# EAGLE schematic FS20SM8_DFF_MPC23017 (EAGLE 7.3.0)
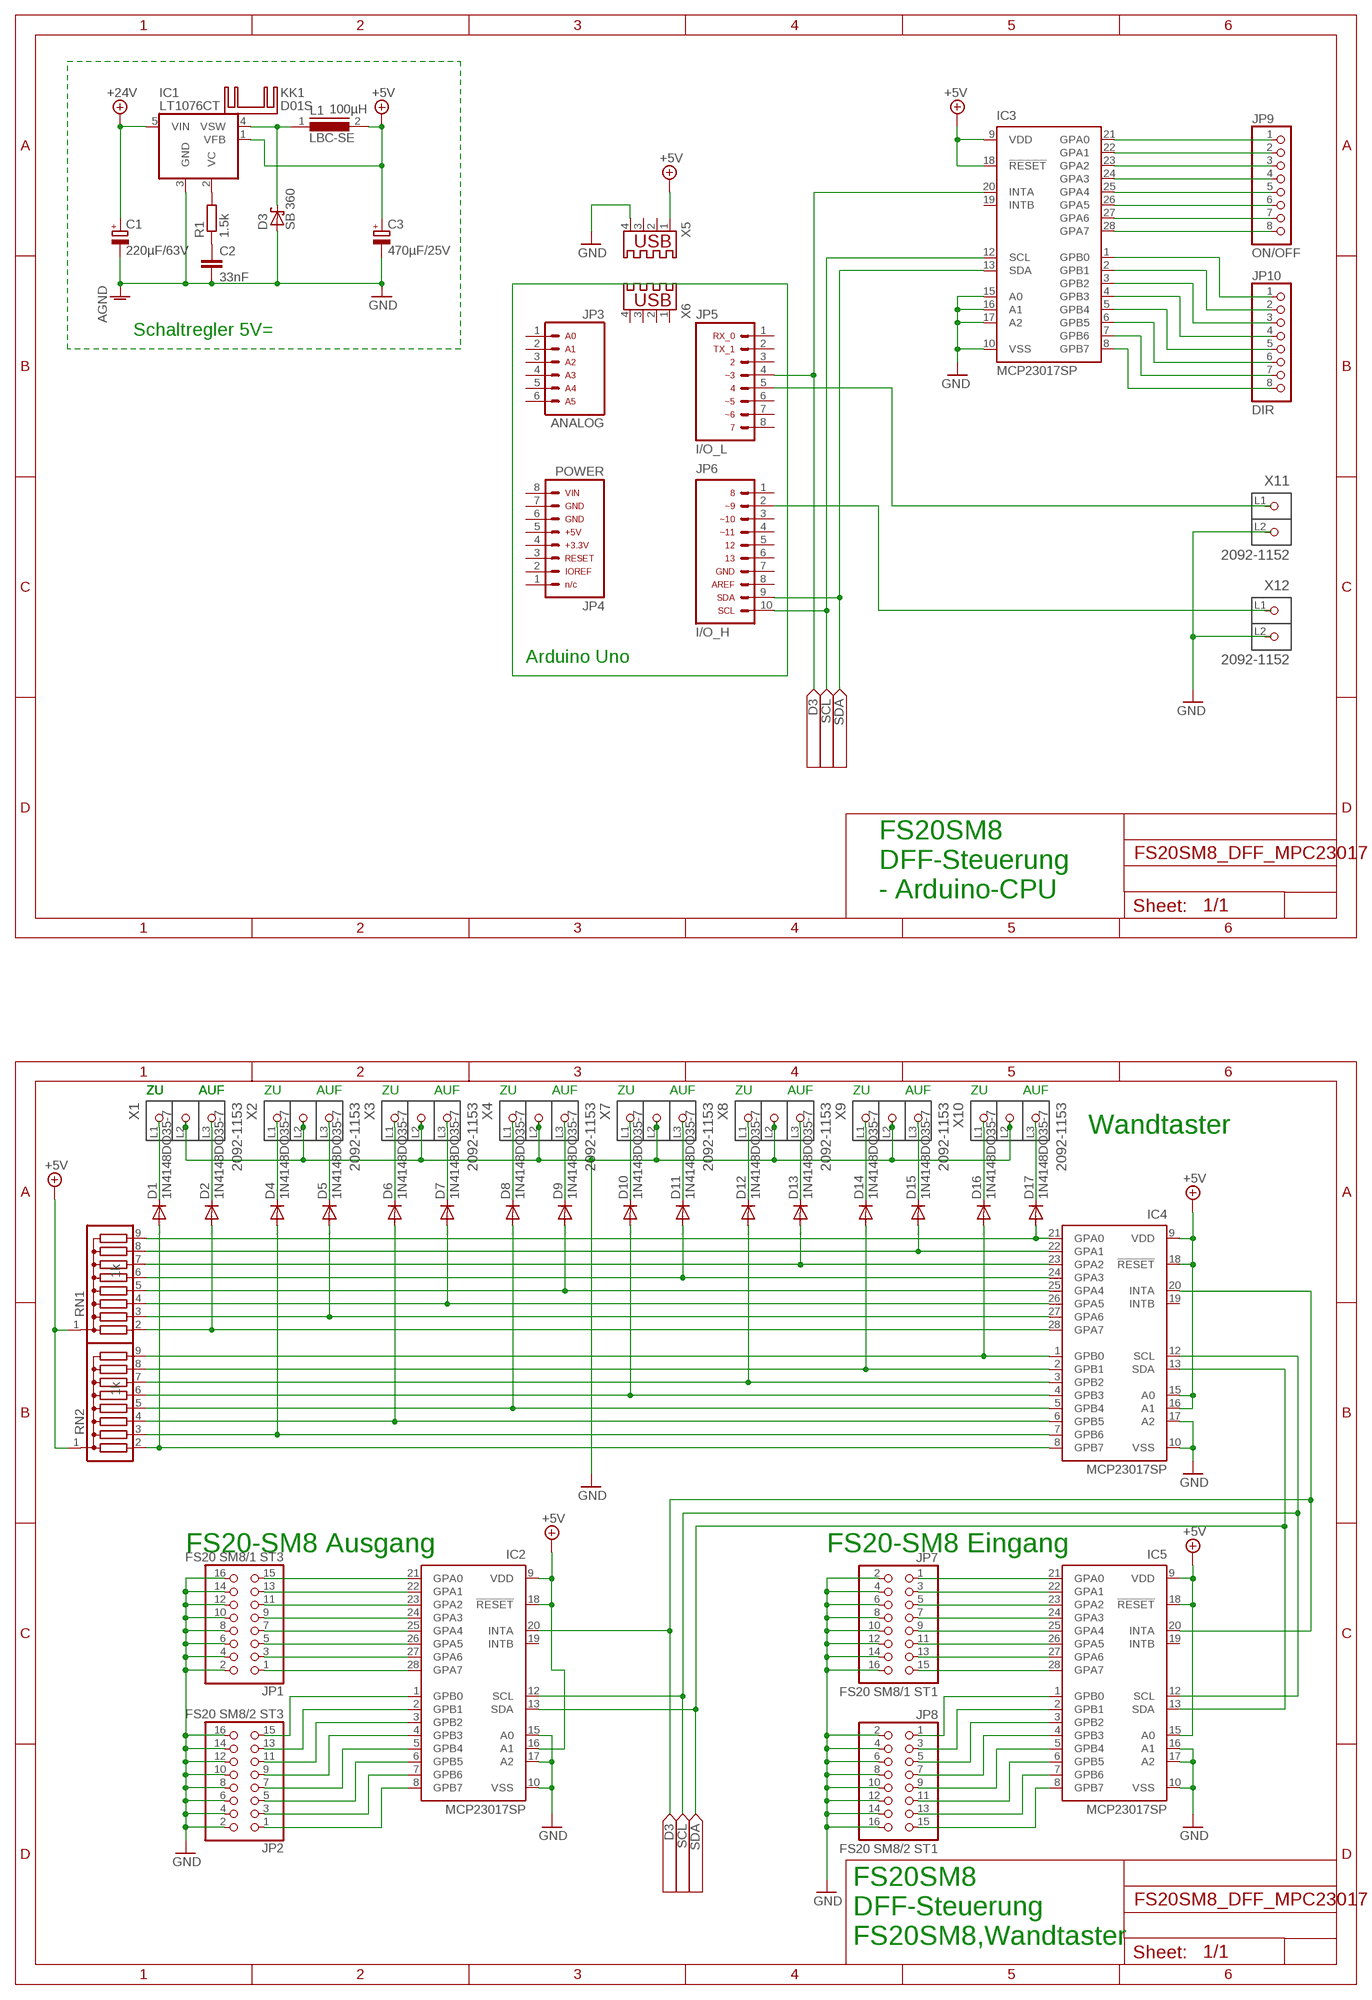
[diagram p0: schematic, sheet 1]

## Parts
C1  220µF/63V  CPOL-EUE5-10.5  [E5-10,5]
C2  33nF  C-EU050-035X075  [C050-035X075]
C3  470µF/25V  CPOL-EUE5-10.5  [E5-10,5]
D1  1N4148DO35-7  [DO35-7]
D2  1N4148DO35-7  [DO35-7]
D3  SB 360  SCHOTTKY-DIODEDO201T15  [DO201T15]
D4  1N4148DO35-7  [DO35-7]
D5  1N4148DO35-7  [DO35-7]
D6  1N4148DO35-7  [DO35-7]
D7  1N4148DO35-7  [DO35-7]
D8  1N4148DO35-7  [DO35-7]
D9  1N4148DO35-7  [DO35-7]
D10  1N4148DO35-7  [DO35-7]
D11  1N4148DO35-7  [DO35-7]
D12  1N4148DO35-7  [DO35-7]
D13  1N4148DO35-7  [DO35-7]
D14  1N4148DO35-7  [DO35-7]
D15  1N4148DO35-7  [DO35-7]
D16  1N4148DO35-7  [DO35-7]
D17  1N4148DO35-7  [DO35-7]
IC1  LT1076CT  [TO220-5]
IC2  MCP23017SP  [DIL28-3]
IC3  MCP23017SP  [DIL28-3]
IC4  MCP23017SP  [DIL28-3]
IC5  MCP23017SP  [DIL28-3]
JP1  FS20 SM8/1 ST3  PINHD-2X8  [2X08]
JP2  FS20 SM8/2 ST3  PINHD-2X8  [2X08]
JP3  ARDUINO_CONN-ANALOGSIP  [CONN-1X06]
JP4  ARDUINO_CONN-POWERSIP  [CONN-1X08]
JP5  ARDUINO_CONN-IO_LSIP  [CONN-1X08]
JP6  ARDUINO_CONN-IO_HSIP  [CONN-1X10]
JP7  FS20 SM8/1 ST1  PINHD-2X8  [2X08]
JP8  FS20 SM8/2 ST1  PINHD-2X8  [2X08]
JP9  ON/OFF  PINHD-1X8  [1X08]
JP10  DIR  PINHD-1X8  [1X08]
KK1  D01S  [D01S]
L1  LBC-SE  [LBC-SE]
R1  1.5k  R-EU_0204/2V  [0204V]
RN1  G08R  [SIL9]
RN2  G08R  [SIL9]
X1  2092-1153  [P-2092-1153]
X2  2092-1153  [P-2092-1153]
X3  2092-1153  [P-2092-1153]
X4  2092-1153  [P-2092-1153]
X5  USB-A003  [USB-A003]
X6  USB-A003  [USB-A003]
X7  2092-1153  [P-2092-1153]
X8  2092-1153  [P-2092-1153]
X9  2092-1153  [P-2092-1153]
X10  2092-1153  [P-2092-1153]
X11  2092-1152  [P-2092-1152]
X12  2092-1152  [P-2092-1152]

## Nets
+5V: C3.+ IC1.1(VFB) IC2.9(VDD) IC2.16(A1) IC2.18(!RESET) IC3.9(VDD) IC3.18(!RESET) IC4.9(VDD) IC4.15(A0) IC4.16(A1) IC4.18(!RESET) IC5.9(VDD) IC5.15(A0) IC5.18(!RESET) L1.2 RN1.1 RN2.1 X5.1
+24V: C1.+ IC1.5(VIN)
AGND: C1.- C2.2 C3.- D3.A IC1.3(GND) ; supply symbol labelled GND
GND: IC2.10(VSS) IC2.15(A0) IC2.17(A2) IC3.10(VSS) IC3.15(A0) IC3.16(A1) IC3.17(A2) IC4.10(VSS) IC4.17(A2) IC5.10(VSS) IC5.16(A1) IC5.17(A2) JP1.2 JP1.4 JP1.6 JP1.8 JP1.10 JP1.12 JP1.14 JP1.16 JP2.2 JP2.4 JP2.6 JP2.8 JP2.10 JP2.12 JP2.14 JP2.16 JP7.2 JP7.4 JP7.6 JP7.8 JP7.10 JP7.12 JP7.14 JP7.16 JP8.2 JP8.4 JP8.6 JP8.8 JP8.10 JP8.12 JP8.14 JP8.16 X1.L2(P2) X2.L2(P2) X3.L2(P2) X4.L2(P2) X5.4 X7.L2(P2) X8.L2(P2) X9.L2(P2) X10.L2(P2)
N$2: JP5.5
N$3: IC3.20(INTA) JP5.4
N$4: IC3.12(SCL) JP6.10
N$5: IC3.13(SDA) JP6.9
N$6: JP6.2
N$12: IC3.1(GPB0) JP10.1
N$13: IC3.2(GPB1) JP10.2
N$14: IC3.3(GPB2) JP10.3
N$15: IC3.4(GPB3) JP10.4
N$16: IC1.2(VC) R1.2
N$17: IC3.5(GPB4) JP10.5
N$18: IC3.6(GPB5) JP10.6
N$19: IC2.21(GPA0) JP1.15
N$20: IC3.7(GPB6) JP10.7
N$21: D1.C X1.L1(P1)
N$22: D2.C X1.L3(P3)
N$23: D5.C X2.L3(P3)
N$24: D4.C X2.L1(P1)
N$25: D7.C X3.L3(P3)
N$26: D6.C X3.L1(P1)
N$27: D8.C X4.L1(P1)
N$28: IC3.21(GPA0) JP9.1
N$29: IC3.22(GPA1) JP9.2
N$30: IC3.23(GPA2) JP9.3
N$31: IC3.24(GPA3) JP9.4
N$32: D9.C X4.L3(P3)
N$33: D10.C X7.L1(P1)
N$34: D11.C X7.L3(P3)
N$35: D12.C X8.L1(P1)
N$36: IC3.25(GPA4) JP9.5
N$37: IC3.26(GPA5) JP9.6
N$38: IC3.27(GPA6) JP9.7
N$39: IC3.28(GPA7) JP9.8
N$48: D13.C X8.L3(P3)
N$49: C2.1 R1.1
N$50: D14.C X9.L1(P1)
N$51: D15.C X9.L3(P3)
N$52: D16.C X10.L1(P1)
N$53: D17.C X10.L3(P3)
N$54: IC3.8(GPB7) JP10.8
N$55: IC5.1(GPB0) JP8.1
N$56: IC5.2(GPB1) JP8.3
N$57: IC5.3(GPB2) JP8.5
N$61: IC2.22(GPA1) JP1.13
N$62: IC2.23(GPA2) JP1.11
N$63: D3.C IC1.4(VSW) L1.1
N$67: IC2.24(GPA3) JP1.9
N$68: IC2.25(GPA4) JP1.7
N$71: IC2.26(GPA5) JP1.5
N$73: IC2.27(GPA6) JP1.3
N$74: IC2.28(GPA7) JP1.1
N$75: IC5.21(GPA0) JP7.1
N$76: IC5.22(GPA1) JP7.3
N$77: IC5.23(GPA2) JP7.5
N$78: IC5.24(GPA3) JP7.7
N$79: IC5.25(GPA4) JP7.9
N$80: IC5.26(GPA5) JP7.11
N$83: IC5.27(GPA6) JP7.13
N$84: IC5.28(GPA7) JP7.15
N$85: IC5.4(GPB3) JP8.7
N$86: IC5.5(GPB4) JP8.9
N$87: IC5.6(GPB5) JP8.11
N$88: IC5.7(GPB6) JP8.13
N$89: IC5.8(GPB7) JP8.15
N$91: IC2.12(SCL) IC4.12(SCL) IC5.12(SCL)
N$92: IC2.13(SDA) IC4.13(SDA) IC5.13(SDA)
N$93: IC2.20(INTA) IC4.20(INTA) IC5.20(INTA)
N$95: D17.A IC4.21(GPA0) RN1.9
N$99: D16.A IC4.1(GPB0) RN2.9
N$100: D14.A IC4.2(GPB1) RN2.8
N$101: D13.A IC4.23(GPA2) RN1.7
N$102: D12.A IC4.3(GPB2) RN2.7
N$103: D11.A IC4.24(GPA3) RN1.6
N$104: D10.A IC4.4(GPB3) RN2.6
N$105: D15.A IC4.22(GPA1) RN1.8
N$106: D9.A IC4.25(GPA4) RN1.5
N$107: D8.A IC4.5(GPB4) RN2.5
N$108: D7.A IC4.26(GPA5) RN1.4
N$109: D6.A IC4.6(GPB5) RN2.4
N$110: D5.A IC4.27(GPA6) RN1.3
N$111: D4.A IC4.7(GPB6) RN2.3
N$112: D2.A IC4.28(GPA7) RN1.2
N$113: D1.A IC4.8(GPB7) RN2.2
N$123: IC2.1(GPB0) JP2.15
N$127: IC2.2(GPB1) JP2.13
N$128: IC2.3(GPB2) JP2.11
N$129: IC2.4(GPB3) JP2.9
N$130: IC2.5(GPB4) JP2.7
N$131: IC2.6(GPB5) JP2.5
N$132: IC2.7(GPB6) JP2.3
N$133: IC2.8(GPB7) JP2.1
Unconnected: IC2.19(INTB) IC3.19(INTB) IC4.19(INTB) IC5.19(INTB) JP3.1 JP3.2 JP3.3 JP3.4 JP3.5 JP3.6 JP4.1 JP4.2 JP4.3 JP4.4 JP4.5 JP4.6 JP4.7 JP4.8 JP5.1 JP5.2 JP5.3 JP5.6 JP5.7 JP5.8 JP6.1 JP6.3 JP6.4 JP6.5 JP6.6 JP6.7 JP6.8 X5.2 X5.3 X6.1 X6.2 X6.3 X6.4 X11.L1(P1) X11.L2(P2) X12.L1(P1) X12.L2(P2)

## Notes on the sheet
- Schaltregler 5V=
- Arduino Uno
- FS20SM8
  DFF-Steuerung
  - Arduino-CPU
- ZU | ZU | ZU | AUF | AUF | ZU | AUF | ZU | AUF | ZU | AUF | ZU | AUF | ZU | AUF | ZU | AUF | ZU | AUF
- Wandtaster
- FS20-SM8 Ausgang | FS20-SM8 Eingang
- FS20SM8
  DFF-Steuerung
  FS20SM8,Wandtaster

## Library data of the parts
C1 C3 = rcl:CPOL-EU: POLARIZED CAPACITOR, European symbol
C2 = rcl:C-EU: CAPACITOR, European symbol
D1 D2 D4-D17 = diode:1N4148: DIODE high speed (Philips)
D3 = diode:SCHOTTKY-DIODE: Schottky Diode
IC1 = linear-technology-2:LT1076*: Step-Down Switching Regulator
IC2-IC5 = microchip:MCP23017: http://ww1.microchip.com/downloads/en/DeviceDoc/21952a.pdf Source: http://ww1.microchip.com/downloads/en/DeviceDoc/21952a.pdf; MF: MICROCHIP; MPN: MCP23017-E/SP; OC_FARNELL: 1332088; OC_NEWARK: 31K2959
JP1 JP2 JP7 JP8 = pinhead:PINHD-2X8: PIN HEADER
JP3 = arduino_jw:ARDUINO_CONN-ANALOG: Arduino Analog I/O Header This is the analog I/O header on the Arduino Uno R3. This connector is labeled with the following pin assignments: Analog 0 Analog 1 Analog 2 Analog 3 Analog 4 Analog 5 NOTE: Be sure you install this connector with the correct orientation on your PCB layout. Pin 1 has a square pad to assist with orientation.
JP4 = arduino_jw:ARDUINO_CONN-POWER: Arduino Power Header This is the power header on the Arduino Uno R3. This connector is labeled with the following pin assignments: n/c IO Ref RESET +3.3V +5V GND GND VIN NOTE: Be sure you install this connector with the correct orientation on your PCB layout. Pin 1 has a square pad to assist with orientation.
JP5 = arduino_jw:ARDUINO_CONN-IO_L: Arduino Digital I/O [Low Byte] Header This is the Digital I/O [low byte] header on the Arduino Uno R3. This connector is labeled with the following pin assignments: Digital 0, Serial Rx Digital 1, Serial Tx Digital 2 Digital 4 Digital 5 [PWM] Digital 6 [PWM] Digital 7 NOTE: Be sure you install this connector with the correct orientation on your PCB layout. Pin 1 has a square pad to assist with orientation.
JP6 = arduino_jw:ARDUINO_CONN-IO_H: Arduino Digital I/O [High Byte] Header This is the Digital I/O [high byte] header on the Arduino Uno R3. This connector is labeled with the following pin assignments: Digital 8 Digital 9 [PWM] Digital 10 [PWM] Digital 11 [PWM] Digital 12 Digital 13 GND AREF SDA SCL NOTE: Be sure you install this connector with the correct orientation on your PCB layout. Pin 1 has a square pad to assist with orientation.
JP9 JP10 = pinhead:PINHD-1X8: PIN HEADER
KK1 = heatsink:D01S: HEATSINK distributor Schukat
L1 = inductors:LBC-SE: INDUCTOR; WERT: 100µH
R1 = resistor:R-EU_: RESISTOR, European symbol
RN1 RN2 = resistor-sil:G08R: SIL RESISTOR; OC_FARNELL: unknown; OC_NEWARK: unknown; WERT: 1k
X1-X4 X7-X10 = con-wago_5.0mm:2092-1153: Serie 2092, Federleiste eCOM mit geraden Lötstiften mit Griffplatte / Series 2092, eCOM pluggable PCB connector with straight solder pins with gripping plate Polzahl / Pole No.: 3 Rastermaß / Pitch: 5 mm Bemessungsspannung / Rated Voltage: 320 V Nennstrom / Nominal Current: 16 A Leiterquerschnitt / Conductor Size: 0.2 - 2.5 mm² Anschlusstechnik / Connection Technology: CAGE CLAMP® S Lötstiftlänge: / Solder Pin Length: 3.6 mm Farbe / Color: lichtgrau / light gray Stand: 01.01.2014. Die jeweils aktuellen Daten zu diesem Artikel finden Sie in unserem Produktkatalog, den Sie unter www.wago.com einsehen können. As of: 01/01/2014. Please find the newest data for this article in our product catalogue, which can be viewed under www.wago.com.
X5 X6 = con-yamaichi:USB-A003: USB connector; OC_FARNELL: unknown; OC_NEWARK: unknown
X11 X12 = con-wago_5.0mm:2092-1152: Serie 2092, Federleiste eCOM mit geraden Lötstiften mit Griffplatte / Series 2092, eCOM pluggable PCB connector with straight solder pins with gripping plate Polzahl / Pole No.: 2 Rastermaß / Pitch: 5 mm Bemessungsspannung / Rated Voltage: 320 V Nennstrom / Nominal Current: 16 A Leiterquerschnitt / Conductor Size: 0.2 - 2.5 mm² Anschlusstechnik / Connection Technology: CAGE CLAMP® S Lötstiftlänge: / Solder Pin Length: 3.6 mm Farbe / Color: lichtgrau / light gray Stand: 01.01.2014. Die jeweils aktuellen Daten zu diesem Artikel finden Sie in unserem Produktkatalog, den Sie unter www.wago.com einsehen können. As of: 01/01/2014. Please find the newest data for this article in our product catalogue, which can be viewed under www.wago.com.

## Net classes
0 default: clearance 0.205 mm